# Altium schematic sheet FLASH_SRAM.SchDoc
size A3
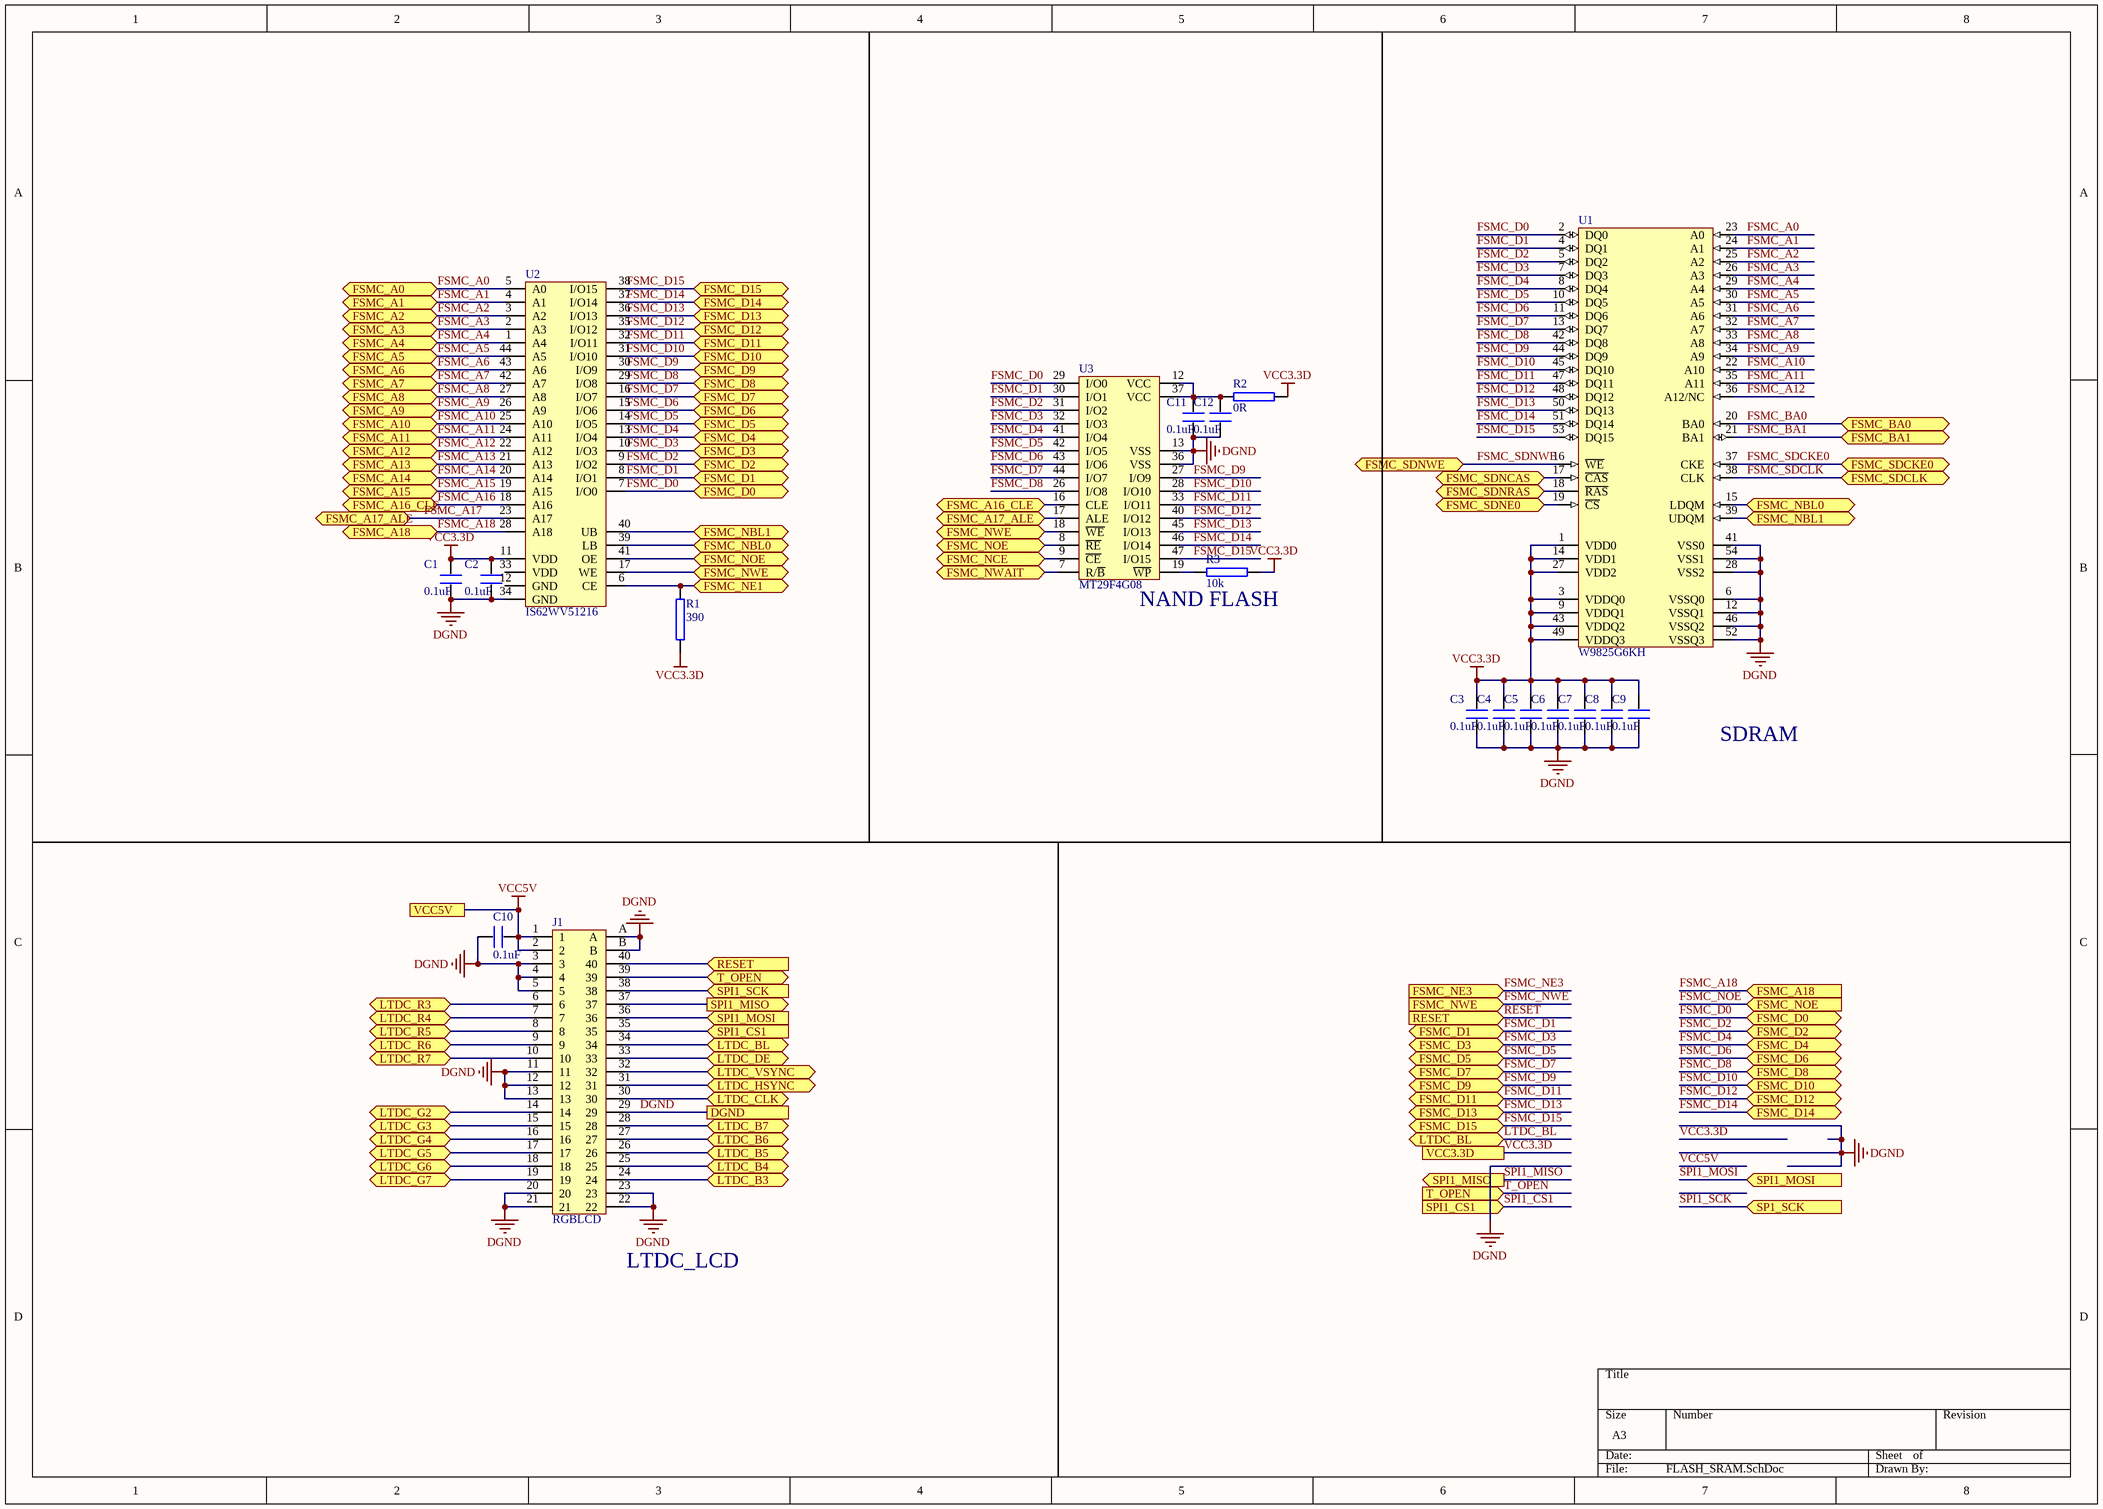
[diagram p0: FLASH_SRAM.SchDoc]

## Parts
C1  0.1uF  [0603P]
C2  0.1uF  [0603P]
C3  0.1uF  [0603P]
C4  0.1uF  [0603P]
C5  0.1uF  [0603P]
C6  0.1uF  [0603P]
C7  0.1uF  [0603P]
C8  0.1uF  [0603P]
C9  0.1uF  [0603P]
C10  0.1uF  [0603P]
C11  0.1uF  [0603P]
C12  0.1uF  [0603P]
J1  RGBLCD  [FPC-TOP40]
R1  390  [0603]
R2  0R  [0603]
R3  10k  [0603]
U1  W9825G6KH  [TSOP54]
U2  IS62WV51216  [TSOP44]
U3  MT29F4G08  [TSOP48]

## Ports
DGND, FSMC_A0 (bidir), FSMC_A1 (bidir), FSMC_A2 (bidir), FSMC_A3 (bidir), FSMC_A4 (bidir), FSMC_A5 (bidir), FSMC_A6 (bidir), FSMC_A7 (bidir), FSMC_A8 (bidir), FSMC_A9 (bidir), FSMC_A10 (bidir), FSMC_A11 (bidir), FSMC_A12 (bidir), FSMC_A13 (bidir), FSMC_A14 (bidir), FSMC_A15 (bidir), FSMC_A16_CLE (bidir), FSMC_A17_ALE (bidir), FSMC_A18 (bidir), FSMC_A18 (in), FSMC_BA0 (bidir), FSMC_BA1 (bidir), FSMC_D0 (bidir), FSMC_D1 (bidir), FSMC_D2 (bidir), FSMC_D3 (bidir), FSMC_D4 (bidir), FSMC_D5 (bidir), FSMC_D6 (bidir), FSMC_D7 (bidir), FSMC_D8 (bidir), FSMC_D9 (bidir), FSMC_D10 (bidir), FSMC_D11 (bidir), FSMC_D12 (bidir), FSMC_D13 (bidir), FSMC_D14 (bidir), FSMC_D15 (bidir), FSMC_NBL0 (bidir), FSMC_NBL1 (bidir), FSMC_NCE (bidir), FSMC_NE1 (bidir), FSMC_NE3 (in), FSMC_NOE (bidir), FSMC_NOE (in), FSMC_NWAIT (bidir), FSMC_NWE (bidir), FSMC_NWE (in), FSMC_SDCKE0 (bidir), FSMC_SDCLK (bidir), FSMC_SDNCAS (bidir), FSMC_SDNE0 (bidir), FSMC_SDNRAS (bidir), FSMC_SDNWE (bidir), LTDC_B3 (bidir), LTDC_B4 (bidir), LTDC_B5 (bidir), LTDC_B6 (bidir), LTDC_B7 (bidir), LTDC_BL, LTDC_BL (bidir), LTDC_CLK (bidir), LTDC_DE (bidir), LTDC_G2 (bidir), LTDC_G3 (bidir), LTDC_G4 (bidir), LTDC_G5 (bidir), LTDC_G6 (bidir), LTDC_G7 (bidir), LTDC_HSYNC (bidir), LTDC_R3 (bidir), LTDC_R4 (bidir), LTDC_R5 (bidir), LTDC_R6 (bidir), LTDC_R7 (bidir), LTDC_VSYNC (bidir), RESET (in), SP1_SCK (in), SPI1_CS1 (in), SPI1_MISO (out), SPI1_MOSI (in), SPI1_SCK (in), T_OPEN (bidir), T_OPEN (in), VCC3.3D, VCC5V

## Nets
DGND: C1.2 C2.2 C3.2 C4.2 C5.2 C6.2 C7.2 C8.2 C9.2 C10.2 C11.2 C12.2 J1.3 J1.4 J1.5 J1.11 J1.12 J1.13 J1.20 J1.21 J1.22 J1.23 J1.29 J1.A J1.B U1.6(VSSQ0) U1.12(VSSQ1) U1.28(VSS2) U1.41(VSS0) U1.46(VSSQ2) U1.52(VSSQ3) U1.54(VSS1) U2.34(GND) U3.13(VSS) U3.36(VSS) ; port DGND
VCC3.3D: C1.1 C2.1 C3.1 C4.1 C5.1 C6.1 C7.1 C8.1 C9.1 R1.2 R2.1 R3.1 U1.1(VDD0) U1.3(VDDQ0) U1.9(VDDQ1) U1.14(VDD1) U1.27(VDD2) U1.43(VDDQ2) U1.49(VDDQ3) U2.11(VDD) ; port VCC3.3D
VCC5V: C10.1 J1.1 J1.2 ; port VCC5V
FSMC_A0: U1.23(A0) U2.5(A0) ; port FSMC_A0
FSMC_A1: U1.24(A1) U2.4(A1) ; port FSMC_A1
FSMC_A2: U1.25(A2) U2.3(A2) ; port FSMC_A2
FSMC_A3: U1.26(A3) U2.2(A3) ; port FSMC_A3
FSMC_A4: U1.29(A4) U2.1(A4) ; port FSMC_A4
FSMC_A5: U1.30(A5) U2.44(A5) ; port FSMC_A5
FSMC_A6: U1.31(A6) U2.43(A6) ; port FSMC_A6
FSMC_A7: U1.32(A7) U2.42(A7) ; port FSMC_A7
FSMC_A8: U1.33(A8) U2.27(A8) ; port FSMC_A8
FSMC_A9: U1.34(A9) U2.26(A9) ; port FSMC_A9
FSMC_A10: U1.22(A10) U2.25(A10) ; port FSMC_A10
FSMC_A11: U1.35(A11) U2.24(A11) ; port FSMC_A11
FSMC_A12: U1.36(A12/NC) U2.22(A12) ; port FSMC_A12
FSMC_A13: U2.21(A13) ; port FSMC_A13
FSMC_A14: U2.20(A14) ; port FSMC_A14
FSMC_A15: U2.19(A15) ; port FSMC_A15
FSMC_A16: U2.18(A16) U3.16(CLE) ; port FSMC_A16_CLE
FSMC_A17: U2.23(A17) U3.17(ALE) ; port FSMC_A17_ALE
FSMC_A18: U2.28(A18) ; port FSMC_A18
FSMC_BA0: U1.20(BA0) ; port FSMC_BA0
FSMC_BA1: U1.21(BA1) ; port FSMC_BA1
FSMC_D0: U1.2(DQ0) U2.7(I/O0) U3.29(I/O0) ; port FSMC_D0
FSMC_D1: U1.4(DQ1) U2.8(I/O1) U3.30(I/O1) ; port FSMC_D1
FSMC_D2: U1.5(DQ2) U2.9(I/O2) U3.31(I/O2) ; port FSMC_D2
FSMC_D3: U1.7(DQ3) U2.10(I/O3) U3.32(I/O3) ; port FSMC_D3
FSMC_D4: U1.8(DQ4) U2.13(I/O4) U3.41(I/O4) ; port FSMC_D4
FSMC_D5: U1.10(DQ5) U2.14(I/O5) U3.42(I/O5) ; port FSMC_D5
FSMC_D6: U1.11(DQ6) U2.15(I/O6) U3.43(I/O6) ; port FSMC_D6
FSMC_D7: U1.13(DQ7) U2.16(I/O7) U3.44(I/O7) ; port FSMC_D7
FSMC_D8: U1.42(DQ8) U2.29(I/O8) U3.26(I/O8) ; port FSMC_D8
FSMC_D9: U1.44(DQ9) U2.30(I/O9) U3.27(I/O9) ; port FSMC_D9
FSMC_D10: U1.45(DQ10) U2.31(I/O10) U3.28(I/O10) ; port FSMC_D10
FSMC_D11: U1.47(DQ11) U2.32(I/O11) U3.33(I/O11) ; port FSMC_D11
FSMC_D12: U1.48(DQ12) U2.35(I/O12) U3.40(I/O12) ; port FSMC_D12
FSMC_D13: U1.50(DQ13) U2.36(I/O13) U3.45(I/O13) ; port FSMC_D13
FSMC_D14: U1.51(DQ14) U2.37(I/O14) U3.46(I/O14) ; port FSMC_D14
FSMC_D15: U1.53(DQ15) U2.38(I/O15) U3.47(I/O15) ; port FSMC_D15
FSMC_NBL0: U1.15(LDQM) U2.39(LB) ; port FSMC_NBL0
FSMC_NBL1: U1.39(UDQM) U2.40(UB) ; port FSMC_NBL1
FSMC_NCE: U3.9(~{CE}) ; port FSMC_NCE
FSMC_NE1: R1.1 U2.6(CE) ; port FSMC_NE1
FSMC_NE3: port FSMC_NE3
FSMC_NOE: U2.41(OE) U3.8(~{RE}) ; port FSMC_NOE
FSMC_NWAIT: U3.7(R/~{B}) ; port FSMC_NWAIT
FSMC_NWE: U2.17(WE) U3.18(~{WE}) ; port FSMC_NWE
FSMC_SDCKE0: U1.37(CKE) ; port FSMC_SDCKE0
FSMC_SDCLK: U1.38(CLK) ; port FSMC_SDCLK
FSMC_SDNCAS: U1.17(~{CAS}) ; port FSMC_SDNCAS
FSMC_SDNE0: U1.19(~{CS}) ; port FSMC_SDNE0
FSMC_SDNRAS: U1.18(~{RAS}) ; port FSMC_SDNRAS
FSMC_SDNWE: U1.16(~{WE}) ; port FSMC_SDNWE
LTDC_B3: J1.24 ; port LTDC_B3
LTDC_B4: J1.25 ; port LTDC_B4
LTDC_B5: J1.26 ; port LTDC_B5
LTDC_B6: J1.27 ; port LTDC_B6
LTDC_B7: J1.28 ; port LTDC_B7
LTDC_BL: J1.34 ; port LTDC_BL
LTDC_CLK: J1.30 ; port LTDC_CLK
LTDC_DE: J1.33 ; port LTDC_DE
LTDC_G2: J1.14 ; port LTDC_G2
LTDC_G3: J1.15 ; port LTDC_G3
LTDC_G4: J1.16 ; port LTDC_G4
LTDC_G5: J1.17 ; port LTDC_G5
LTDC_G6: J1.18 ; port LTDC_G6
LTDC_G7: J1.19 ; port LTDC_G7
LTDC_HSYNC: J1.31 ; port LTDC_HSYNC
LTDC_R3: J1.6 ; port LTDC_R3
LTDC_R4: J1.7 ; port LTDC_R4
LTDC_R5: J1.8 ; port LTDC_R5
LTDC_R6: J1.9 ; port LTDC_R6
LTDC_R7: J1.10 ; port LTDC_R7
LTDC_VSYNC: J1.32 ; port LTDC_VSYNC
RESET: J1.40 ; port RESET
SPI1_CS1: J1.35 ; port SPI1_CS1
SPI1_MISO: J1.37 ; port SPI1_MISO
SPI1_MOSI: J1.36 ; port SPI1_MOSI
SPI1_SCK: J1.38 ; port SPI1_SCK
SPI1_SCK: port SP1_SCK  [a separate net that carries the same name]
T_OPEN: J1.39 ; port T_OPEN
NetC11_1: C11.1 C12.1 R2.2 U3.12(VCC) U3.37(VCC)
NetR3_2: R3.2 U3.19(~{WP})

Not connected (* = marked no-connect by the designer): U2 12(GND) 33(VDD)

## Notes on the sheet
- NAND FLASH
- SDRAM
- (near J1) LTDC_LCD

## Library data of the parts
C1-C12 = C
J1 = FPC-40: FPC-40P-0.5mm
R1-R3 = RES
U1 = IS42S16160B: 32MB SDRAM